# Altium schematic sheet mcu.SchDoc: Triumvi - MCU - CC2538
size Letter; Author: Ye-Sheng Kuo; Revision: 10; SheetNumber: 2; SheetTotal: 5
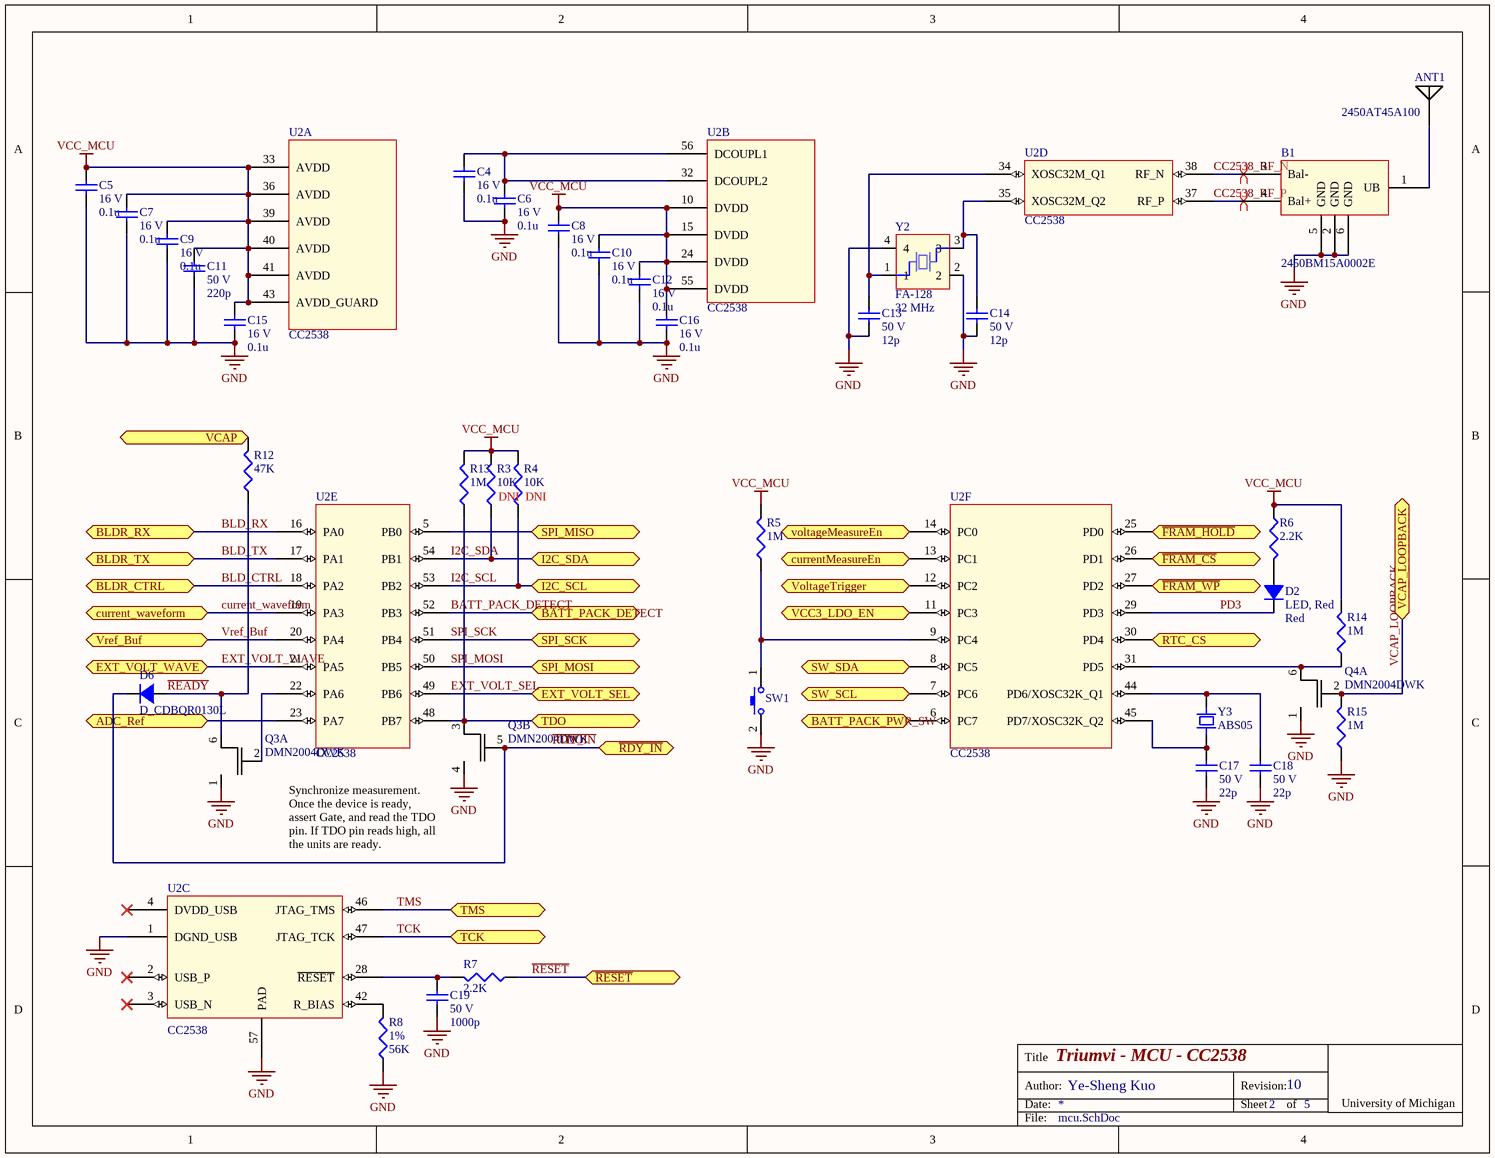
[diagram p0: mcu.SchDoc]

## Parts
ANT1  2450AT45A100  [2450AT45A100]
B1  2450BM15A0002E  [2450BM15A0002]
C4  value 0.1u  voltage rated: 16 V  [0402]  (hidden comment: Ceramic capacitor)
C5  value 0.1u  voltage rated: 16 V  [0402]  (hidden comment: Ceramic capacitor)
C6  value 0.1u  voltage rated: 16 V  [0402]  (hidden comment: Ceramic capacitor)
C7  value 0.1u  voltage rated: 16 V  [0402]  (hidden comment: Ceramic capacitor)
C8  value 0.1u  voltage rated: 16 V  [0402]  (hidden comment: Ceramic capacitor)
C9  value 0.1u  voltage rated: 16 V  [0402]  (hidden comment: Ceramic capacitor)
C10  value 0.1u  voltage rated: 16 V  [0402]  (hidden comment: Ceramic capacitor)
C11  value 220p  voltage rated: 50 V  [0402]  (hidden comment: Ceramic capacitor)
C12  value 0.1u  voltage rated: 16 V  [0402]  (hidden comment: Ceramic capacitor)
C13  value 12p  voltage rated: 50 V  [0402]  (hidden comment: Ceramic capacitor)
C14  value 12p  voltage rated: 50 V  [0402]  (hidden comment: Ceramic capacitor)
C15  value 0.1u  voltage rated: 16 V  [0402]  (hidden comment: Ceramic capacitor)
C16  value 0.1u  voltage rated: 16 V  [0402]  (hidden comment: Ceramic capacitor)
C17  value 22p  voltage rated: 50 V  [0402]  (hidden comment: Ceramic capacitor)
C18  value 22p  voltage rated: 50 V  [0402]  (hidden comment: Ceramic capacitor)
C19  value 1000p  voltage rated: 50 V  [0402]  (hidden comment: Ceramic capacitor)
D2  LED, Red  Color: Red  [0402 - DIODE]
D6  D_CDBQR0130L  [0402 - DIODE]
Q3  DMN2004DWK  [SC70-6]  (parts A,B of 2)
Q4  DMN2004DWK  [SC70-6]  (part A of 2)
R3  value 10K  [0402]  (hidden comment: Chip resistor)
R4  value 10K  [0402]  (hidden comment: Chip resistor)
R5  value 1M  [0402]  (hidden comment: Chip resistor)
R6  value 2.2K  [0402]  (hidden comment: Chip resistor)
R7  value 2.2K  [0402]  (hidden comment: Chip resistor)
R8  value 56K  tolerance: 1%  [0402]  (hidden comment: Chip resistor)
R12  value 47K  [0402]  (hidden comment: Chip resistor)
R13  value 1M  [0402]  (hidden comment: Chip resistor)
R14  value 1M  [0402]  (hidden comment: Chip resistor)
R15  value 1M  [0402]  (hidden comment: Chip resistor)
SW1  EVQP7C  [EVQP7C]  (value not drawn)
U2  CC2538  [QFN56]  (parts A,B,C,D,E,F of 6)
Y2  FA-128  frequency: 32 MHz  [FA-128]
Y3  ABS05  [ABS05]

## Ports
ADC_Ref, BATT_PACK_DETECT, BATT_PACK_PWR_SW, BLDR_CTRL, BLDR_RX, BLDR_TX, current_waveform, currentMeasureEn, EXT_VOLT_SEL, EXT_VOLT_WAVE, I2C_SCL, I2C_SDA, RTC_CS, SPI_MISO, SPI_MOSI, SPI_SCK, SW_SCL, SW_SDA, TCK, TDO, TMS, VCAP, VCAP_LOOPBACK, VCC3_LDO_EN, voltageMeasureEn, VoltageTrigger, Vref_Buf, ~{FRAM_CS}, ~{FRAM_HOLD}, ~{FRAM_WP}, ~{RDY_IN}, ~{RESET}

## Nets
GND: B1.2(GND) B1.5(GND) B1.6(GND) C4.2 C5.2 C6.2 C7.2 C8.2 C9.2 C10.2 C11.2 C12.2 C13.1 C14.1 C15.2 C16.2 C17.2 C18.2 C19.2 Q3.1(S2) Q3.4(S1) Q4.1(S2) R8.2 R15.2 SW1.2 U2.1(DGND_USB) U2.57(PAD) Y2.2 Y2.4
VCC_MCU: C5.1 C7.1 C8.1 C9.1 C10.1 C11.1 C12.1 C15.1 C16.1 R3.1 R4.1 R5.1 R6.2 R13.1 R14.1 U2.10(DVDD) U2.15(DVDD) U2.24(DVDD) U2.33(AVDD) U2.36(AVDD) U2.39(AVDD) U2.40(AVDD) U2.41(AVDD) U2.43(AVDD_GUARD) U2.55(DVDD)
ADC_Ref: U2.23(PA7) ; port ADC_Ref
BATT_PACK_DETECT: U2.52(PB3) ; port BATT_PACK_DETECT
BATT_PACK_PWR_SW: U2.6(PC7) ; port BATT_PACK_PWR_SW
BLD_CTRL: U2.18(PA2) ; port BLDR_CTRL
BLD_RX: U2.16(PA0) ; port BLDR_RX
BLD_TX: U2.17(PA1) ; port BLDR_TX
CC2538_RF_N: B1.3(Bal-) U2.38(RF_N)
CC2538_RF_P: B1.4(Bal+) U2.37(RF_P)
current_waveform: U2.19(PA3) ; port current_waveform
currentMeasureEn: U2.13(PC1) ; port currentMeasureEn
EXT_VOLT_SEL: U2.49(PB6) ; port EXT_VOLT_SEL
EXT_VOLT_WAVE: U2.21(PA5) ; port EXT_VOLT_WAVE
~{FRAM_CS}: U2.26(PD1) ; port ~{FRAM_CS}
~{FRAM_HOLD}: U2.25(PD0) ; port ~{FRAM_HOLD}
~{FRAM_WP}: U2.27(PD2) ; port ~{FRAM_WP}
I2C_SCL: R4.2 U2.53(PB2) ; port I2C_SCL
I2C_SDA: R3.2 U2.54(PB1) ; port I2C_SDA
PD3: D2.2 U2.29(PD3)
~{RDY_IN}: D6.2 Q3.5(G1) ; port ~{RDY_IN}  [also labelled TDO]
~{READY}: D6.1 Q3.6(D2) R12.2
~{RESET}: R7.2 ; port ~{RESET}
RTC_CS: U2.30(PD4) ; port RTC_CS
SPI_MISO: U2.5(PB0) ; port SPI_MISO
SPI_MOSI: U2.50(PB5) ; port SPI_MOSI
SPI_SCK: U2.51(PB4) ; port SPI_SCK
SW_SCL: U2.7(PC6) ; port SW_SCL
SW_SDA: U2.8(PC5) ; port SW_SDA
TCK: U2.47(JTAG_TCK) ; port TCK
TDO: Q3.3(D1) R13.2 U2.48(PB7) ; port TDO
TMS: U2.46(JTAG_TMS) ; port TMS
VCAP: R12.1 ; port VCAP
VCAP_LOOPBACK: Q4.2(G2) R15.1 ; port VCAP_LOOPBACK
VCC3_LDO_EN: U2.11(PC3) ; port VCC3_LDO_EN
voltageMeasureEn: U2.14(PC0) ; port voltageMeasureEn
VoltageTrigger: U2.12(PC2) ; port VoltageTrigger
Vref_Buf: U2.20(PA4) ; port Vref_Buf
NetANT1_1: ANT1.1 B1.1(UB)
NetC4_1: C4.1 C6.1 U2.32(DCOUPL2) U2.56(DCOUPL1)
NetC13_2: C13.2 U2.34(XOSC32M_Q1) Y2.1
NetC14_2: C14.2 U2.35(XOSC32M_Q2) Y2.3
NetC17_1: C17.1 U2.45(PD7/XOSC32K_Q2) Y3.2
NetC18_1: C18.1 U2.44(PD6/XOSC32K_Q1) Y3.1
NetC19_1: C19.1 R7.1 U2.28(~{RESET})
NetD2_1: D2.1 R6.1
NetQ3_2: Q3.2(G2) U2.22(PA6)
NetQ4_6: Q4.6(D2) R14.2 U2.31(PD5)
NetR5_2: R5.2 SW1.1 U2.9(PC4)
NetR8_1: R8.1 U2.42(R_BIAS)

Not connected (* = marked no-connect by the designer): U2 2(USB_P)* 3(USB_N)* 4(DVDD_USB)*

## Layout directives
differential pair: CC2538_RF_N, CC2538_RF_P

## Notes on the sheet
- DNI
- (near R4) DNI
- (near Q3) Synchronize measurement. Once the device is ready, assert Gate, and read the TDO pin. If TDO pin reads high, all the units are ready.
- Title
- Date:
- Author:
- Revision:
- Sheet
- of
- University of Michigan
- File:

## Library data of the parts
ANT1 = 2450AT45A100: 2.45 GHz High Gain SMD Chip Antenna; Supplier 1: Digi-Key; Supplier Part Number 1: 712-1012-1-ND
B1 = 2450BM15A0002E: 2.45 GHz Balun for TI CC253X; Supplier 1: Digi-Key; Supplier Part Number 1: 712-1536-1-ND
C4-C10 C12 C15 C16 = C_0.1u_16V_0402_ceramic: Ceramic capacitor, 0.1u, 16 V, 0402 package; Manufacture: Murata; tolerance: 10%; Temperature Coef: X7R; package: 0402; Supplier 1: Digi-Key; Supplier Part Number 1: 490-3261-1-ND
C11 = C_220p_50V_0402_ceramic: Ceramic capacitor, 220 pF, 0402 package; Manufacture: Johanson; tolerance: 10%; package: 0402; Temperature: X7R; Supplier 1: Digi-Key; Supplier Part Number 1: 445-1254-1-ND
C13 C14 = C_12p_0402_ceramic: Ceramic capacitor, 12 pF, 0402 package; Manufacture: Johanson; tolerance: 2%; package: 0402; Supplier 1: Digi-Key; Supplier Part Number 1: 712-1256-1-ND
C17 C18 = C_22p_0402_ceramic: Ceramic capacitor, 22 pF, 0402 package; Manufacture: Johanson; tolerance: 2%; package: 0402; Supplier 1: Digi-Key; Supplier Part Number 1: 712-1274-1-ND
C19 = C_1000p_50V_0402_ceramic: Ceramic capacitor, 1000 pF, 0402 package; Manufacture: TDK; tolerance: 10%; package: 0402; Supplier 1: Digi-Key; Supplier Part Number 1: 445-6846-1-ND
D2 = D_LED_RED_0402: LED, Red, 0402; package: 0402; Supplier 1: Digi-Key; Supplier Part Number 1: 511-1593-1-ND
D6 = D_CDBQR0130L: SMD Schottky Barrier Diode; package: 0402; Supplier 1: Digi-Key; Supplier Part Number 1: 641-1271-1-ND
Q3 Q4 = DMN2004DWK: DUAL N-CHANNEL ENHANCEMENT MODE MOSFET; Supplier 1: Digi-Key; Supplier Part Number 1: DMN2004DWKDICT-ND
R3 R4 = R_10K_0402: Chip resistor, 10K, 0402 package; tolerance: 1%; power: 1/16 W; Supplier 1: Digi-Key; Supplier Part Number 1: 541-10.0KLCT-ND; package: 0402
R5 R13-R15 = R_1M_0402: Chip resistor, 1M, 0402 package; tolerance: 1%; power: 1/16 W; Supplier 1: Digi-Key; Supplier Part Number 1: 541-1.00MLCT-ND; package: 0402
R6 R7 = R_2.2K_0402: Chip resistor, 2.2K, 0402 package; tolerance: 1%; power: 1/16 W; package: 0402; Supplier 1: Digi-Key; Supplier Part Number 1: 541-2.20KLCT-ND
R8 = R_56K_0402_1%: Chip resistor, 56K, 0402 package; power: 1/16 W; Temperature coefficient: 100 ppm/C; package: 0402; Supplier 1: Digi-Key; Supplier Part Number 1: 541-56.0KLCT-ND
R12 = R_47K_0402: Chip resistor, 47K, 0402 package; tolerance: 1%; power: 1/16 W; package: 0402; Supplier 1: Digi-Key; Supplier Part Number 1: 541-47.0KLCT-ND
SW1 = EVQP7C: 3.5 mm×2.9 mm Side-operational SMD  Light Touch Switches; Supplier 1: Digi-Key; Supplier Part Number 1: P16769CT-ND
U2 = CC2538: A Powerful System-On-Chip for 2.4-GHz IEEE 802.15.4, 6LoWPAN  and ZigBee Applications; Supplier 1: Digi-Key; Supplier Part Number 1: 296-35797-1-ND
Y2 = FA-128: MHz Range Crystal Unit; Load capatance: 10 pF; ESR: 60; stability: 20 ppm; Supplier 1: Digi-Key; Supplier Part Number 1: SER3800CT-ND
Y3 = ABS05: 32768 Hz SMD Low profile crystal; Supplier 1: Digi-Key; Supplier Part Number 1: 535-11899-1-ND